# EAGLE design clap_switch_pth (EAGLE 8.3.2)
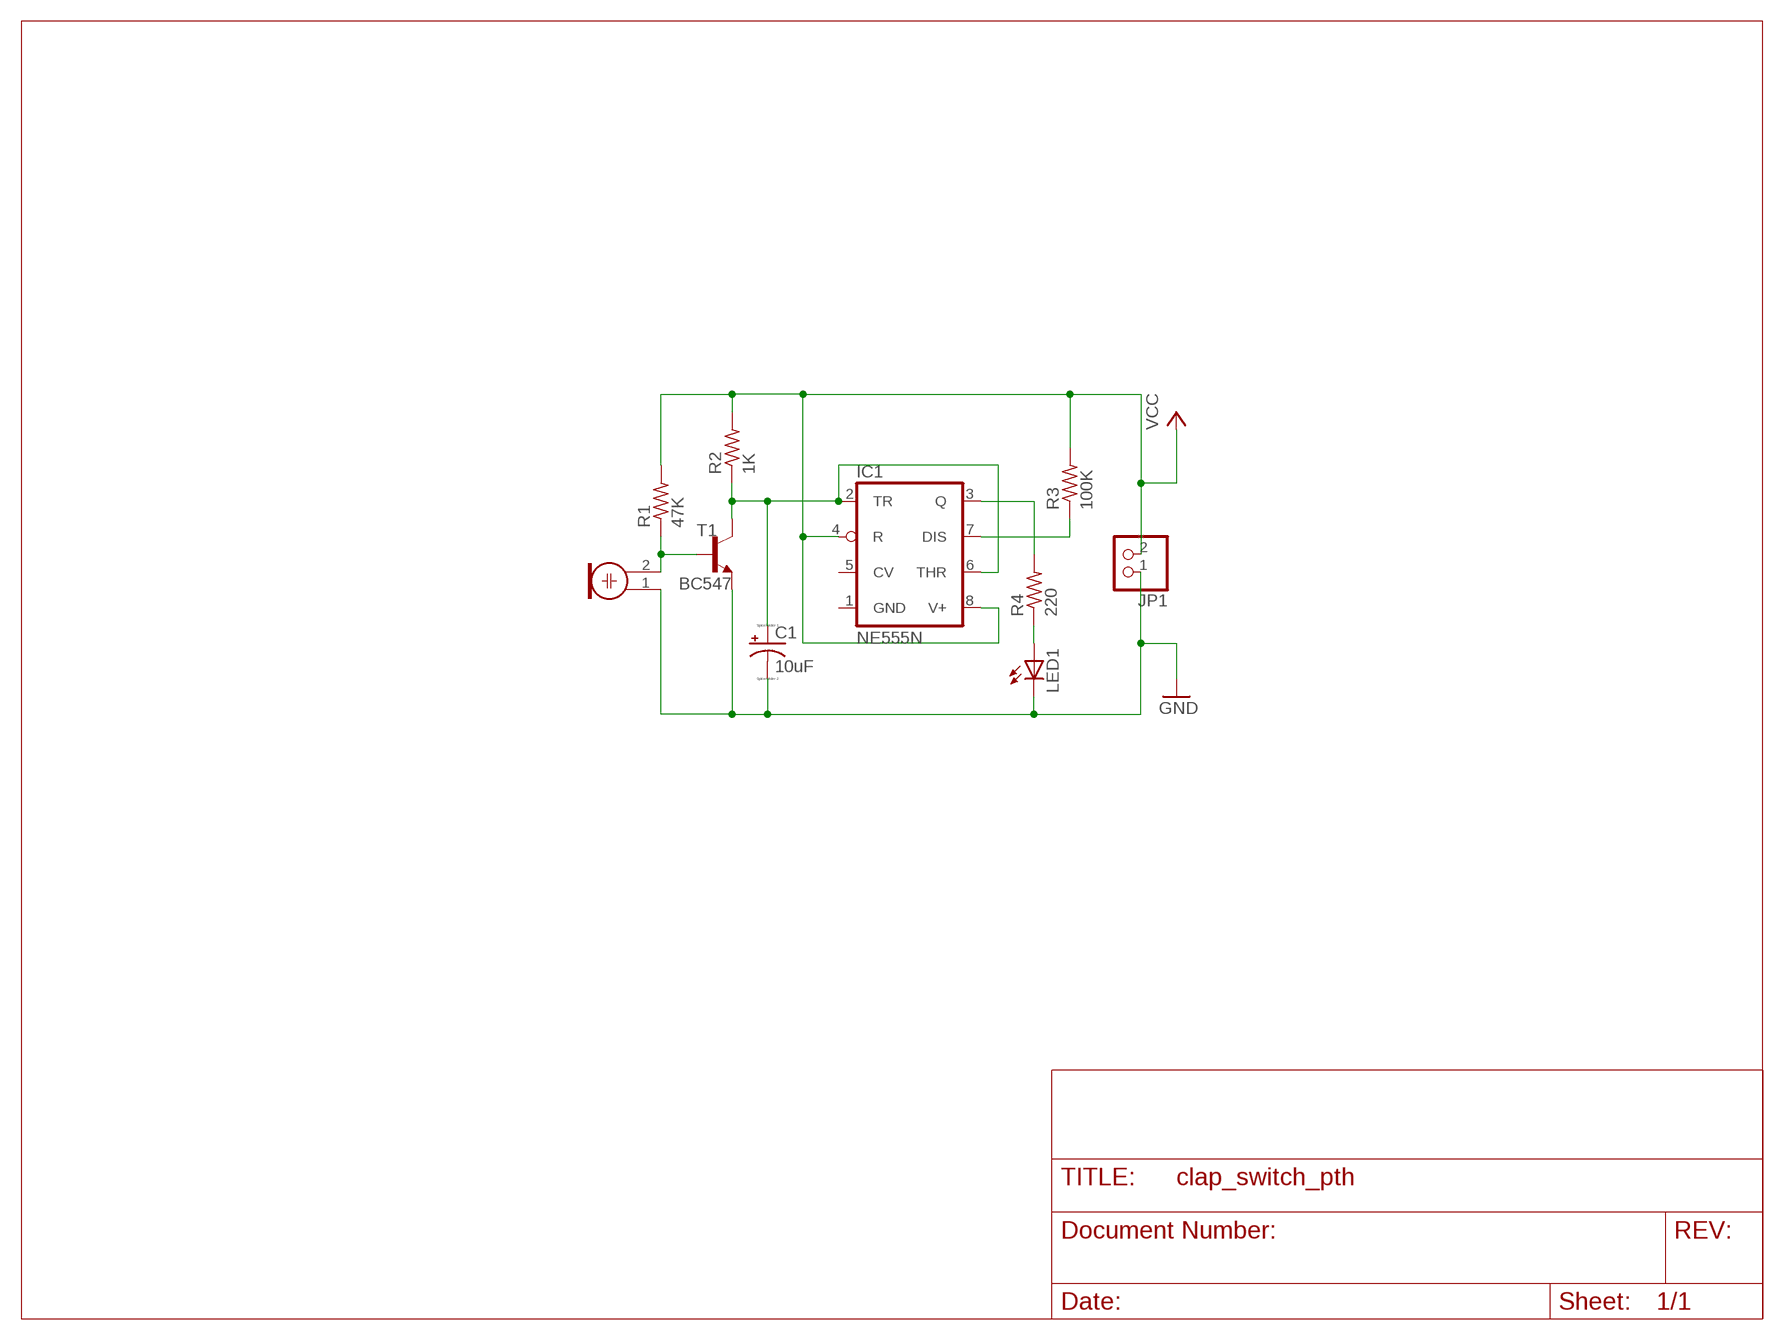
[diagram p0: schematic, sheet 1]

## Parts
C1  10uF  CPOL-USE2.5-7  [E2,5-7]
IC1  NE555N  [DIL08]
JP1  PINHD-1X2  [1X02]
LED1  LED5MM  [LED5MM]
M1  MIC  ELECTRET_MICROPHON-F6050AP  [F6050AP]
R1  47K  R-US_0207/7  [0207/7]
R2  1K  R-US_0207/7  [0207/7]
R3  100K  R-US_0207/7  [0207/7]
R4  220  R-US_0207/7  [0207/7]
T1  BC547  [TO92]

## Nets
GND: C1.- JP1.1 LED1.K(C) M1.1 T1.1(E)
N$2: C1.+ IC1.2(TR) IC1.6(THR) R2.1 T1.3(C)
N$3: M1.2 R1.1 T1.2(B)
N$5: IC1.7(DIS) R3.1
N$6: IC1.3(Q) R4.2
N$7: LED1.A R4.1
VCC: IC1.4(R) IC1.8(V+) JP1.2 R1.2 R2.2 R3.2
Unconnected: IC1.5(CV)

## Power pins joined to a net without a drawn wire
GND: IC1.1(GND)

## Library data of the parts
C1 = resistor:CPOL-US: POLARIZED CAPACITOR, American symbol
IC1 = linear:*555: TIMER
JP1 = pinhead:PINHD-1X2: PIN HEADER
LED1 = led:LED: LED OSRAM: - CHIPLED LG R971, LG N971, LY N971, LG Q971, LY Q971, LO R971, LY R971 LH N974, LH R974 LS Q976, LO Q976, LY Q976 LO Q996 - Hyper CHIPLED LW Q18S LB Q993, LB Q99A, LB R99A - SideLED LS A670, LO A670, LY A670, LG A670, LP A670 LB A673, LV A673, LT A673, LW A673 LH A674 LY A675 LS A676, LA A676, LO A676, LY A676, LW A676 LS A679, LY A679, LG A679 - Hyper Micro SIDELED® LS Y876, LA Y876, LO Y876, LY Y876 LT Y87S - SmartLED LW L88C, LW L88S LB L89C, LB L89S, LG L890 LS L89K, LO L89K, LY L89K LS L896, LA L896, LO L896, LY L896 - TOPLED LS T670, LO T670, LY T670, LG T670, LP T670 LSG T670, LSP T670, LSY T670, LOP T670, LYG T670 LG T671, LOG T671, LSG T671 LB T673, LV T673, LT T673, LW T673 LH T674 LS T676, LA T676, LO T676, LY T676, LB T676, LH T676, LSB T676, LW T676 LB T67C, LV T67C, LT T67C, LS T67K, LO T67K, LY T67K, LW E67C LS E67B, LA E67B, LO E67B, LY E67B, LB E67C, LV E67C, LT E67C LW T67C LS T679, LY T679, LG T679 LS T770, LO T770, LY T770, LG T770, LP T770 LB T773, LV T773, LT T773, LW T773 LH T774 LS E675, LA E675, LY E675, LS T675 LS T776, LA T776, LO T776, LY T776, LB T776 LHGB T686 LT T68C, LB T68C - Hyper Mini TOPLED® LB M676 - Mini TOPLED Santana® LG M470 LS M47K, LO M47K, LY M47K Source: http://www.osram.convergy.de LUXEON: - LUMILED® LXK2-PW12-R00, LXK2-PW12-S00, LXK2-PW14-U00, LXK2-PW14-V00 LXK2-PM12-R00, LXK2-PM12-S00, LXK2-PM14-U00 LXK2-PE12-Q00, LXK2-PE12-R00, LXK2-PE12-S00, LXK2-PE14-T00, LXK2-PE14-U00 LXK2-PB12-K00, LXK2-PB12-L00, LXK2-PB12-M00, LXK2-PB14-N00, LXK2-PB14-P00, LXK2-PB14-Q00 LXK2-PR12-L00, LXK2-PR12-M00, LXK2-PR14-Q00, LXK2-PR14-R00 LXK2-PD12-Q00, LXK2-PD12-R00, LXK2-PD12-S00 LXK2-PH12-R00, LXK2-PH12-S00 LXK2-PL12-P00, LXK2-PL12-Q00, LXK2-PL12-R00 Source: www.luxeon.com KINGBRIGHT: KA-3528ASYC Source: www.kingbright.com
M1 = microphon:ELECTRET_MICROPHON-: Electret Condenser Microphone
R1-R4 = resistor:R-US_: RESISTOR, American symbol
T1 = transistor:BC547: NPN TRANSISTOR

## Board
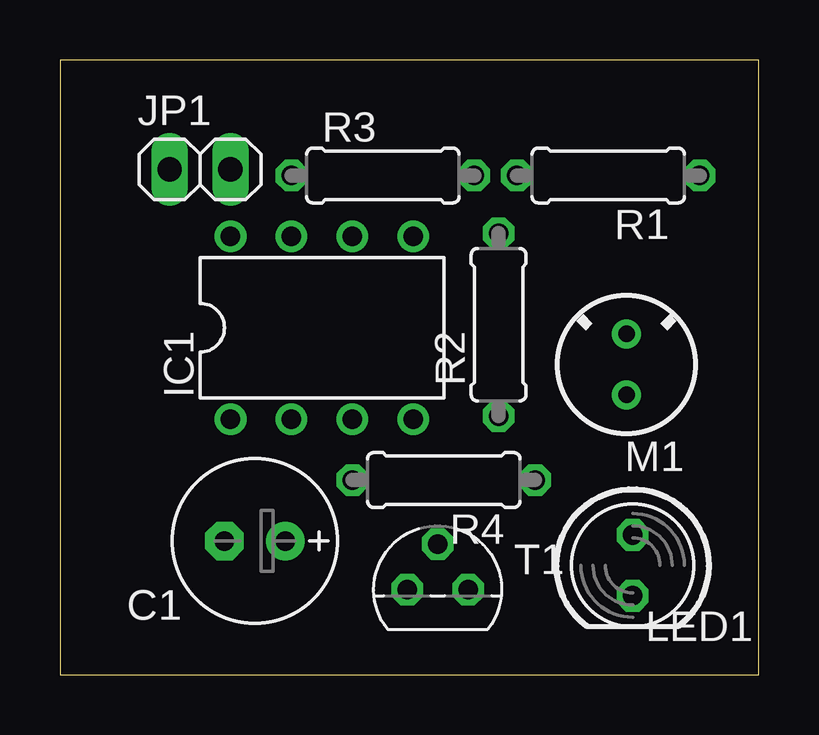
[diagram p1: board, top side]
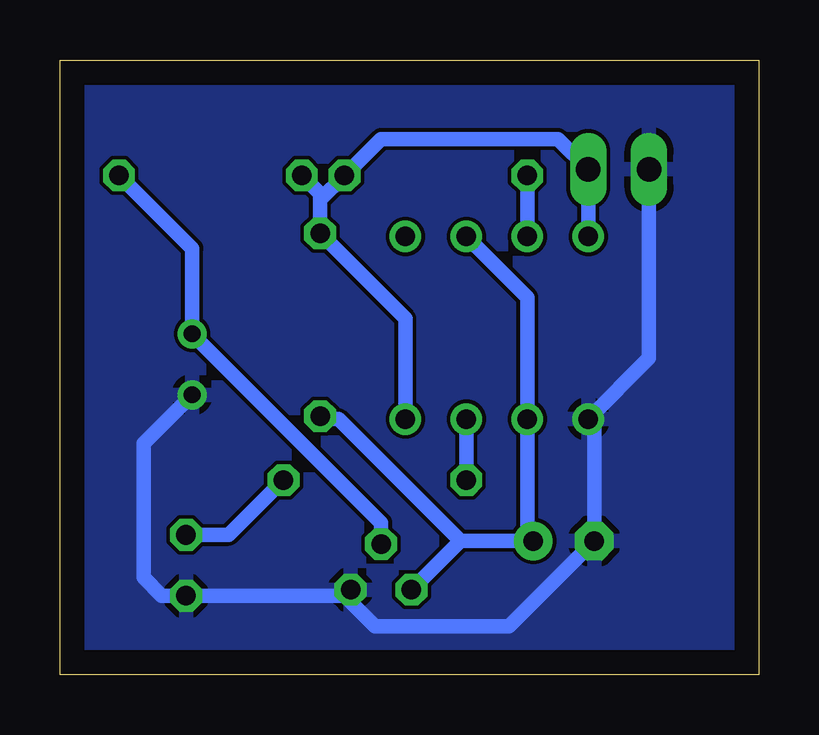
[diagram p2: board, bottom side, seen from below]

Size 29.13 x 25.64 mm. Coordinates in mm from the lower left corner, seen from the top.
Outline: 0,0 29.13,0 29.13,25.64 0,25.64 0,0
Copper layers (1*16): Top 0.035mm / dielectric 1.5mm / Bottom 0.035mm
Design rules "default": minimum track width 6mil, minimum drill 0.35mm, track to track 6mil, track to pad 6mil, pad to pad 6mil, via to via 6mil, smd to smd 6mil, copper to edge 40mil, drill to drill 6mil, minimum pad ring 10mil, minimum via ring 8mil, stop-mask expansion 4mil, vias tented up to drill 0mil, thermal gap 10mil

### Footprints (pad centres in the part's own frame; a part is rotated, then mirrored left to right if it is on the bottom)
E2,5-7 = drill 0.813 pad 1.6: + -1.27,0 | drill 0.813 pad 1.6 octagon: - 1.27,0
DIL08 = drill 0.813 pad 1.27: 1 -3.81,-3.81; 2 -1.27,-3.81; 3 1.27,-3.81; 4 3.81,-3.81; 5 3.81,3.81; 6 1.27,3.81; 7 -1.27,3.81; 8 -3.81,3.81
1X02 = drill 1.016 long: 1 -1.27,0; 2 1.27,0
LED5MM = drill 0.813 octagon: A -1.27,0; K 1.27,0
F6050AP = drill 0.7 pad 1.2: 1 0,1.27; 2 0,-1.27
0207/7 = drill 0.813 octagon: 1 -3.81,0; 2 3.81,0
TO92 = drill 0.813 octagon: 1 1.27,0; 2 0,1.905; 3 -1.27,0

### Placement (x,y rotation side)
C1  8.13,5.59 180 top
IC1  10.92,14.48 0 top
JP1  5.84,21.08 0 top
LED1  23.88,4.57 270 top
M1  23.62,12.95 180 top
R1  22.86,20.83 180 top
R2  18.29,14.61 90 top
R3  13.46,20.83 0 top
R4  16,8.13 180 top
T1  15.75,3.56 0 top

### Tracks (layer width: path | path; a pad name or v marks a point on that pad's centre or on a via)
GND
  Bottom 0.61: JP1.1 4.57,13.21 IC1.1 6.86,10.41 C1.- 10.41,2.03 16,2.03 17.02,3.05 T1.1 17.27,3.3 LED1.K 24.89,3.3 25.65,4.06 25.65,9.65 M1.1
  pour Bottom: 2.29,24.89 28.7,24.89 28.7,1.02 0.76,1.02 0.76,24.89
N$2
  Bottom 0.61: 12.45,5.59 C1.+ 9.65,5.84 IC1.2 9.65,15.75 IC1.6 | 12.45,5.59 T1.3 | 12.45,5.59 17.53,10.67 18.16,10.67 R2.1
N$3
  Bottom 0.61: T1.2 15.75,6.35 M1.2 23.62,17.78 R1.1
N$5
  Bottom 0.61: IC1.7 R3.1
N$6
  Bottom 0.61: R4.2 IC1.3
N$7
  Bottom 0.61: LED1.A 22.1,5.84 R4.1
VCC
  Bottom 0.61: IC1.8 JP1.2 8.38,22.35 15.75,22.35 R3.2 18.29,19.81 | 18.29,19.81 R2.2 14.73,14.86 IC1.4 | 18.29,19.81 18.29,20.07 R1.2